# EAGLE schematic tempcontroller_schematic (EAGLE 6.5.0)
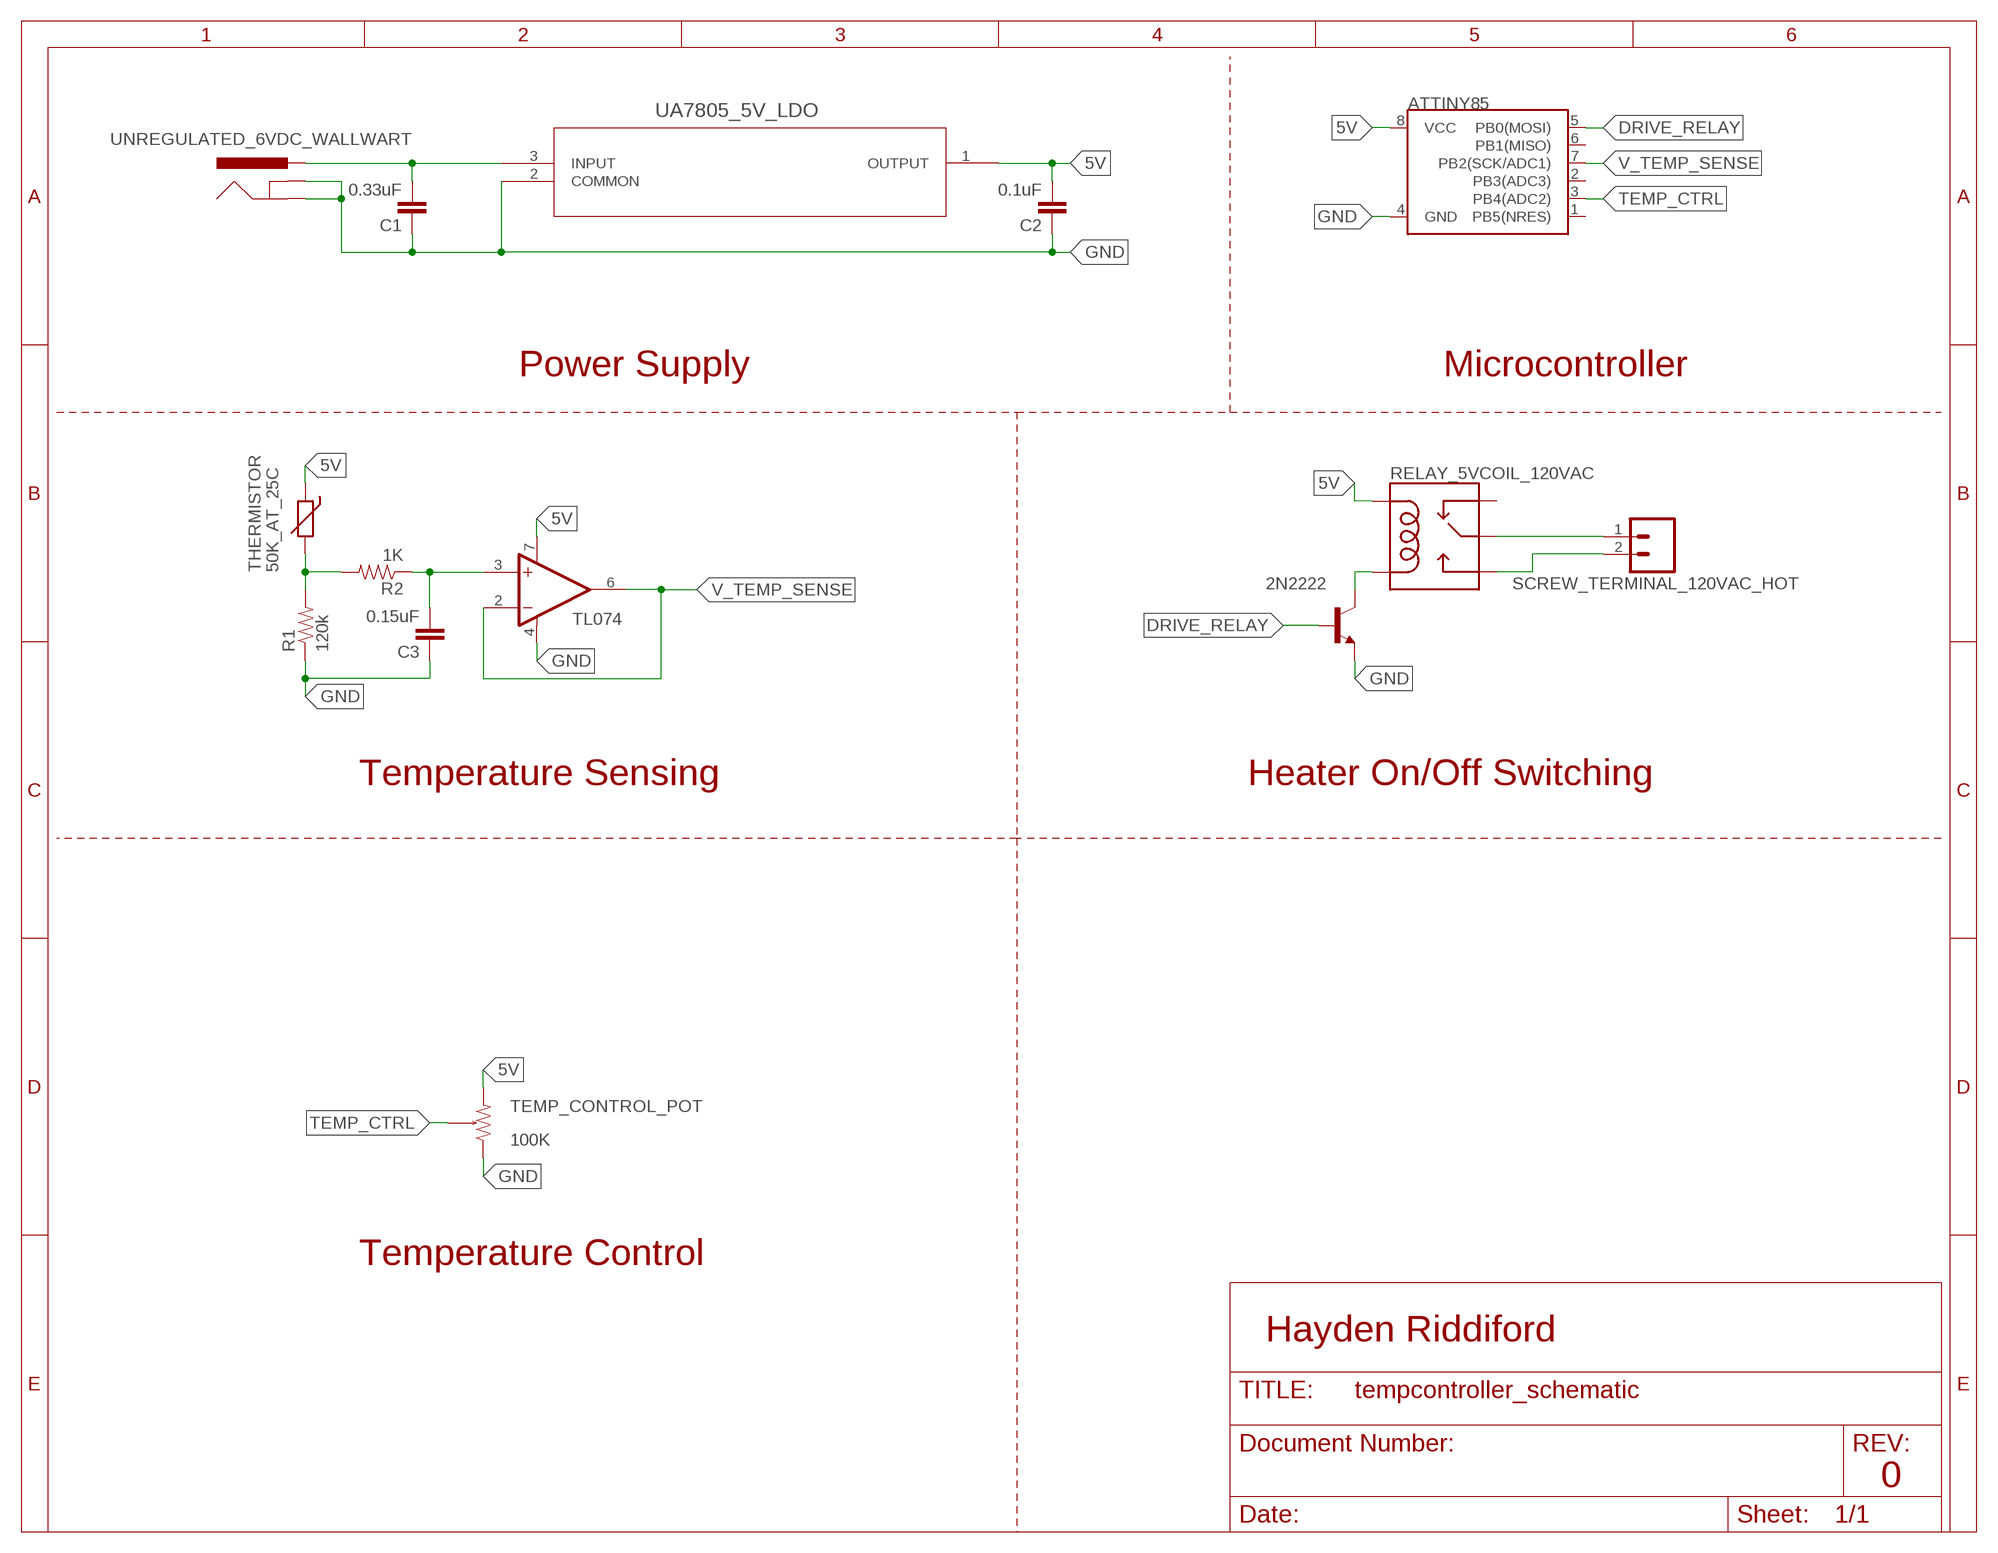
[diagram p0: schematic, sheet 1]

## Parts
ATTINY85  TINY85-20-DIP  ATTINY45TINY85-20-DIP  [DIP08]
C1  0.33uF  CAP_  [AXIAL-5MM]
C2  0.1uF  CAP_  [AXIAL-5MM]
C3  0.15uF  CAP_  [AXIAL-5MM]
R1  120k  RESISTORAXIAL-0.3  [AXIAL-0.3]
R2  1K  RESISTORAXIAL-0.3  [AXIAL-0.3]
RELAY_5VCOIL_120VAC  RELAYPTH  [RELAY-G5Q]
SCREW_TERMINAL_120VAC_HOT  M02POLAR  [MOLEX-1X2]
T1  2N2222  [TO92-EBC-OVAL]
TEMP_CONTROL_POT  100K  POTENTIOMETER  [0603-ARV]
THERMISTOR  50K_AT_25C  THERMISTOR_R-5  [R-5]
TL074  MAX430PA  [DIL08]
UA7805_5V_LDO  UA7805_KCS_3  [KCS3]
UNREGULATED_6VDC_WALLWART  POWER_JACKPTH  [POWER_JACK_PTH]

## Nets
5V: ATTINY85.8(VCC) C2.P$2 RELAY_5VCOIL_120VAC.5(COIL1) TEMP_CONTROL_POT.2 THERMISTOR.1 TL074.7(V+) UA7805_5V_LDO.1(OUTPUT)
DRIVE_RELAY: ATTINY85.5(PB0(MOSI)) T1.B
GND: ATTINY85.4(GND) C1.P$1 C2.P$1 C3.P$1 R1.P$1 T1.E TEMP_CONTROL_POT.1 TL074.4(V-) UA7805_5V_LDO.2(COMMON) UNREGULATED_6VDC_WALLWART.GND UNREGULATED_6VDC_WALLWART.GNDBREAK
N$1: C1.P$2 UA7805_5V_LDO.3(INPUT) UNREGULATED_6VDC_WALLWART.PWR
N$2: R1.P$2 R2.P$2 THERMISTOR.2
N$3: RELAY_5VCOIL_120VAC.1(COIL2) T1.C
N$4: C3.P$2 R2.P$1 TL074.3(+IN)
N$5: RELAY_5VCOIL_120VAC.2(MAIN) SCREW_TERMINAL_120VAC_HOT.1
N$6: RELAY_5VCOIL_120VAC.3(NO) SCREW_TERMINAL_120VAC_HOT.2
TEMP_CTRL: ATTINY85.3(PB4(ADC2)) TEMP_CONTROL_POT.3 TEMP_CONTROL_POT.4 TEMP_CONTROL_POT.5 TEMP_CONTROL_POT.6 TEMP_CONTROL_POT.7 TEMP_CONTROL_POT.8
V_TEMP_SENSE: ATTINY85.7(PB2(SCK/ADC1)) TL074.2(-IN) TL074.6(OUT)
Unconnected: ATTINY85.1(PB5(NRES)) ATTINY85.2(PB3(ADC3)) ATTINY85.6(PB1(MISO)) RELAY_5VCOIL_120VAC.4(NC)

## Notes on the sheet
- Power Supply | Microcontroller
- Temperature Sensing | Heater On/Off Switching
- Temperature Control
- Hayden Riddiford
- 0

## Library data of the parts
ATTINY85 = SparkFun-DigitalIC:ATTINY45: Atmel 8-pin 2/4/8kB flash uC; PROD_ID: IC-09445
C1-C3 = SparkFun-Passives:CAP: Capacitor Standard 0603 ceramic capacitor, and 0.1" leaded capacitor.
R1 R2 = SparkFun-Passives:RESISTOR: Resistor Basic schematic elements and footprints for 0603, 1206, and PTH resistors.
RELAY_5VCOIL_120VAC = SparkFun-Electromechanical:RELAY: SPDT relay (COM-00101)
SCREW_TERMINAL_120VAC_HOT = SparkFun-Connectors:M02: Standard 2-pin 0.1" header. Use with - straight break away headers ( PRT-00116) - right angle break away headers (PRT-00553) - swiss pins (PRT-00743) - machine pins (PRT-00117) - female headers (PRT-00115) Molex polarized connector foot print use with: PRT-08233 with associated crimp pins and housings. 2.54_SCREWTERM for use with PRT-10571. 3.5mm Screw Terminal footprints for PRT-08084 5mm Screw Terminal footprints for use with PRT-08432
T1 = adafruit:2N2222: NPN TRANSISTOR Big oval pads
TEMP_CONTROL_POT = SparkFun-Passives:POTENTIOMETER
THERMISTOR = discrete:THERMISTOR_: Thermo Resistor
TL074 = maxim:MAX430PA: OP AMP; OC_FARNELL: unknown; OC_NEWARK: unknown
UA7805_5V_LDO = ua7805_TI:UA7805_KCS_3; DATASHEETURL: http://www.ti.com/lit/gpn/UA7805; DESCRIPTION: 3 Pin 1.5A Fixed 5V Positive Voltage Regulator; FAMILY_NAME: STANDARD VOLTAGE REGULATOR; GENERIC_PART_NUMBER: UA7805; INDUSTRY_STD_PKG_TYPE: TO-220; MANUFACTURER: Texas Instruments; MANUFACTURER_PART_NUMBER: ua7805_kcs_3; PACKAGE_DESIGNATOR: KCS; PIN_COUNT: 3; VENDOR: Texas Instruments
UNREGULATED_6VDC_WALLWART = SparkFun-Connectors:POWER_JACK: Power Jack This is the standard 5.5mm barrel jack for power. The PTH is the most common, proven, reliable, footprint. The Slot footprint only works if the mill layer is transmitted to the PCB fab house so be warned. Mating wall wart : TOL-00298 (and others); PROD_ID: CONN-08197